# Altium schematic sheet PWM_PPM_FMU_REV_1A.SchDoc: Pixhawk_mini_8L.sch
size A4; Date: 18/08/2014 1:53:26 PM; DrawnBy: Philip Rowse; SheetNumber: 8; SheetTotal: 10
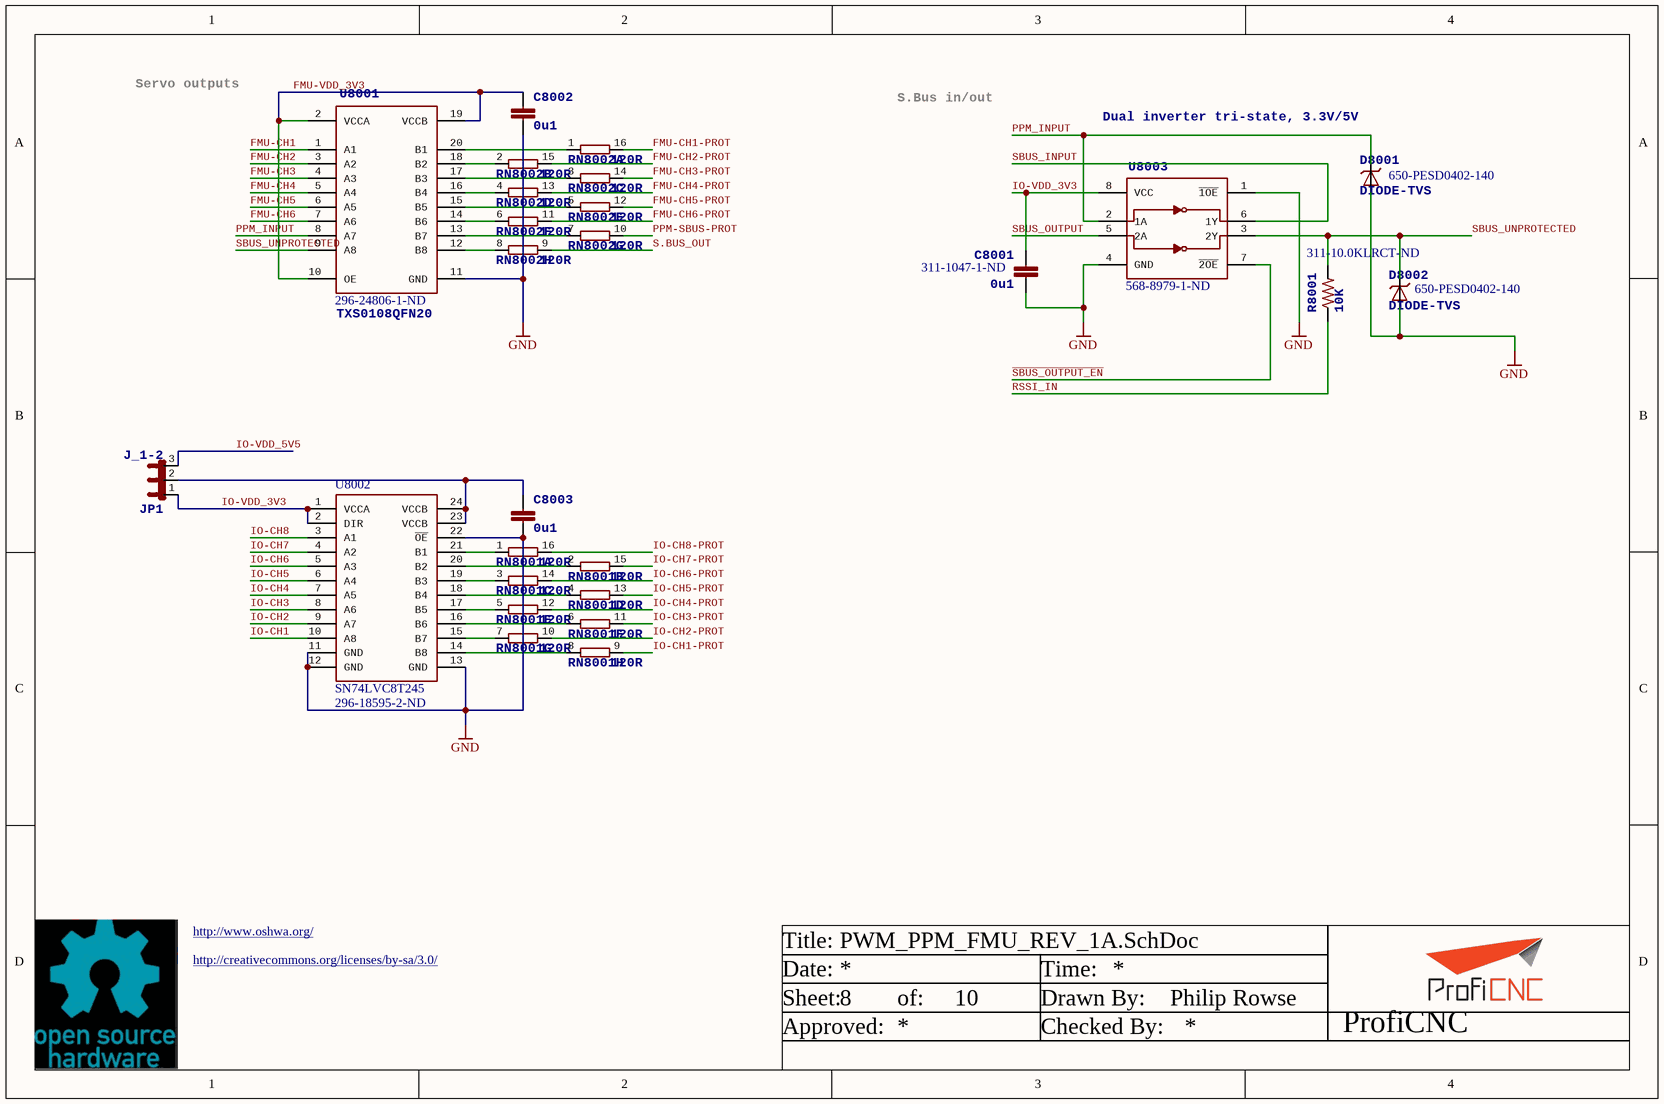
[diagram p0: PWM_PPM_FMU_REV_1A.SchDoc]

## Parts
C8001  0u1  Supplier Part Number 1: 311-1047-1-ND  [0402-CAP]
C8002  0u1  [0402-CAP]
C8003  0u1  [0402-CAP]
D8001  DIODE-TVS  Supplier Part Number 1: 650-PESD0402-140  [0402-TVS]
D8002  DIODE-TVS  Supplier Part Number 1: 650-PESD0402-140  [0402-TVS]
JP1  J_1-2  [SJ_3_NO_PLACE_1-2_short]
R8001  10K  Supplier Part Number 1: 311-10.0KLRCT-ND  [0402-RES]
RN8001  120R  [EXB2HV]  (parts A,B,C,D,E,F,G,H of 8)
RN8002  120R  [EXB2HV]  (parts A,B,C,D,E,F,G,H of 8)
U8001  TXS0108QFN20  Supplier Part Number 1: 296-24806-1-ND  [QFN20-RGY]
U8002  SN74LVC8T245  Supplier Part Number 1: 296-18595-2-ND  [QFN24-RGY]
U8003  Dual inverter tri-state, 3.3V/5V  Supplier Part Number 1: 568-8979-1-ND  [TSSOP8_SOT505-2]

## Nets
GND: C8001.P$2 C8002.P$2 C8003.P$2 D8001.A D8002.A U8001.11(GND) U8002.11(GND) U8002.12(GND) U8002.13(GND) U8002.22(~{OE}) U8003.1(~{1OE}) U8003.4(GND)
FMU-CH1: U8001.1(A1)
FMU-CH1-PROT: RN8002.16
FMU-CH2: U8001.3(A2)
FMU-CH2-PROT: RN8002.15
FMU-CH3: U8001.4(A3)
FMU-CH3-PROT: RN8002.14
FMU-CH4: U8001.5(A4)
FMU-CH4-PROT: RN8002.13
FMU-CH5: U8001.6(A5)
FMU-CH5-PROT: RN8002.12
FMU-CH6: U8001.7(A6)
FMU-CH6-PROT: RN8002.11
FMU-VDD_3V3: C8002.P$1 U8001.2(VCCA) U8001.10(OE) U8001.19(VCCB)
IO-CH1: U8002.10(A8)
IO-CH1-PROT: RN8001.9
IO-CH2: U8002.9(A7)
IO-CH2-PROT: RN8001.10
IO-CH3: U8002.8(A6)
IO-CH3-PROT: RN8001.11
IO-CH4: U8002.7(A5)
IO-CH4-PROT: RN8001.12
IO-CH5: U8002.6(A4)
IO-CH5-PROT: RN8001.13
IO-CH6: U8002.5(A3)
IO-CH6-PROT: RN8001.14
IO-CH7: U8002.4(A2)
IO-CH7-PROT: RN8001.15
IO-CH8: U8002.3(A1)
IO-CH8-PROT: RN8001.16
IO-VDD_3V3: C8001.P$1 JP1.1 U8002.1(VCCA) U8002.2(DIR) U8003.8(VCC)
IO-VDD_5V5: JP1.3
PPM-SBUS-PROT: RN8002.10
PPM_INPUT: D8001.C U8001.8(A7) U8003.2(1A)
RSSI_IN: R8001.P$1
S.BUS_OUT: RN8002.9
~{SBUS_OUTPUT_EN}: U8003.7(~{2OE})
SBUS_INPUT: U8003.6(1Y)
SBUS_OUTPUT: U8003.5(2A)
SBUS_UNPROTECTED: D8002.C R8001.P$2 U8001.9(A8) U8003.3(2Y)
NetC8003_P$1: C8003.P$1 JP1.2 U8002.23(VCCB) U8002.24(VCCB)
NetRN8001_1: RN8001.1 U8002.21(B1)
NetRN8001_2: RN8001.2 U8002.20(B2)
NetRN8001_3: RN8001.3 U8002.19(B3)
NetRN8001_4: RN8001.4 U8002.18(B4)
NetRN8001_5: RN8001.5 U8002.17(B5)
NetRN8001_6: RN8001.6 U8002.16(B6)
NetRN8001_7: RN8001.7 U8002.15(B7)
NetRN8001_8: RN8001.8 U8002.14(B8)
NetRN8002_1: RN8002.1 U8001.20(B1)
NetRN8002_2: RN8002.2 U8001.18(B2)
NetRN8002_3: RN8002.3 U8001.17(B3)
NetRN8002_4: RN8002.4 U8001.16(B4)
NetRN8002_5: RN8002.5 U8001.15(B5)
NetRN8002_6: RN8002.6 U8001.14(B6)
NetRN8002_7: RN8002.7 U8001.13(B7)
NetRN8002_8: RN8002.8 U8001.12(B8)

## Notes on the sheet
- Servo outputs
- S.Bus in/out
- http://www.oshwa.org/
- http://creativecommons.org/licenses/by-sa/3.0/
- Title:
- Date:
- Time:
- Sheet:
- Approved:
- of:
- Drawn By:
- Checked By:
- ProfiCNC

## Library data of the parts
C8001-C8003 = CAP0402: CAP CER 0.1UF 16V Y5V 0402; PARTNO: CC0402ZRY5V7BB104; 3DR_PARTNO: ECM0700; Supplier 1: Digi-Key; Value: 0u1
  C8002 C8003: Supplier Part Number 1: 311-1047-1-ND
D8001 D8002 = DIODE-TVS: TVS DIODE 14VWM 40VC 0402; 3DR_PARTNO: ECM0837; PARTNO: PESD0402-140; Value: 40v; Supplier 1: Mouser
JP1 = JUMPER-31-2
R8001 = RESISTOR0402-RES: RES 10K OHM 1/16W 1% 0402 SMD; PARTNO: RC0402FR-0710KL; 3DR_PARTNO: ECM0800; Supplier 1: Digi-Key; Value: 10K
RN8001 RN8002 = 8R-NEXB2HV-220R: RES ARRAY 120 OHM 8 RES 1506; PARTNO: EXB-2HV121JV; 3DR_PARTNO: ECM0266; OC_FARNELL: unknown; OC_NEWARK: unknown; Supplier 1: Digi-Key; Supplier Part Number 1: Y1121CT-ND; Value: 120R
U8001 = TXS0108QFN20: IC XLATR VOLT-LVL 8B BDIR 20QFN; 3DR_PARTNO: ECM0845; PARTNO: TXS0108ERGYR; Supplier 1: Digi-Key
U8003 = 74LVC2G240-TSSOP-8: IC INVERTER DUAL 4-INPUT 8TSSOP; 3DR_PARTNO: ECM0817; PARTNO: 74LVC2G240DP,125; Value: INV; Supplier 1: Digi-Key
U8002 = SN74LVC8T245: Supplier 1: Digi-Key